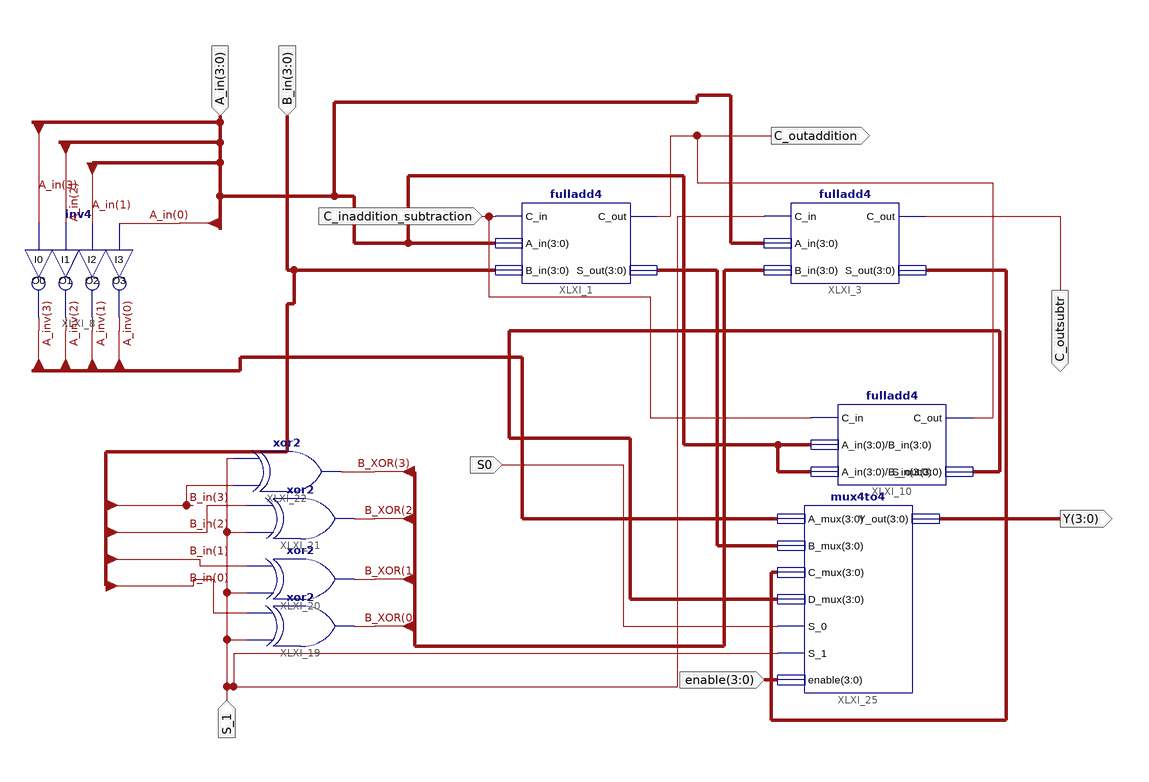
[diagram p0: schematic sheet 1]
// Xilinx ISE schematic ALU.sch (spartan6) as structural Verilog: 9 symbols, 9 ports
module ALU (
  input  [3:0] B_in,
  input  [3:0] A_in,
  input  S0,
  input  S_1,
  input  [3:0] enable,
  input  C_inaddition_subtraction,
  output [3:0] Y,
  output C_outaddition,
  output C_outsubtr
);

  wire [3:0] A_inv, B_XOR, XLXN_41, XLXN_48, XLXN_49;

  fulladd4 XLXI_1 (.C_in(C_inaddition_subtraction), .A_in(A_in), .B_in(B_in), .C_out(C_outaddition), .S_out(XLXN_48));
  fulladd4 XLXI_3 (.C_in(S_1), .A_in(A_in), .B_in(B_XOR), .C_out(C_outsubtr), .S_out(XLXN_49));
  inv4 XLXI_8 (
    .I0(A_in[3]), .I1(A_in[2]), .I2(A_in[1]), .I3(A_in[0]), .O0(A_inv[3]), .O1(A_inv[2]), .O2(A_inv[1]),
    .O3(A_inv[0]));
  fulladd4 XLXI_10 (.C_in(C_inaddition_subtraction), .A_in(A_in), .B_in(A_in), .C_out(C_outaddition), .S_out(XLXN_41));
  xor XLXI_19 (B_XOR[0], S_1, B_in[0]);
  xor XLXI_20 (B_XOR[1], S_1, B_in[1]);
  xor XLXI_21 (B_XOR[2], S_1, B_in[2]);
  xor XLXI_22 (B_XOR[3], B_in[3], S_1);
  mux4to4 XLXI_25 (
    .A_mux(A_inv), .B_mux(XLXN_48), .C_mux(XLXN_49), .D_mux(XLXN_41), .S_0(S0), .S_1(S_1), .enable(enable),
    .Y_out(Y));
endmodule
